# Altium schematic sheet 13-MT7688AN Peripheral-C.SchDoc
size 558 x 457 mm
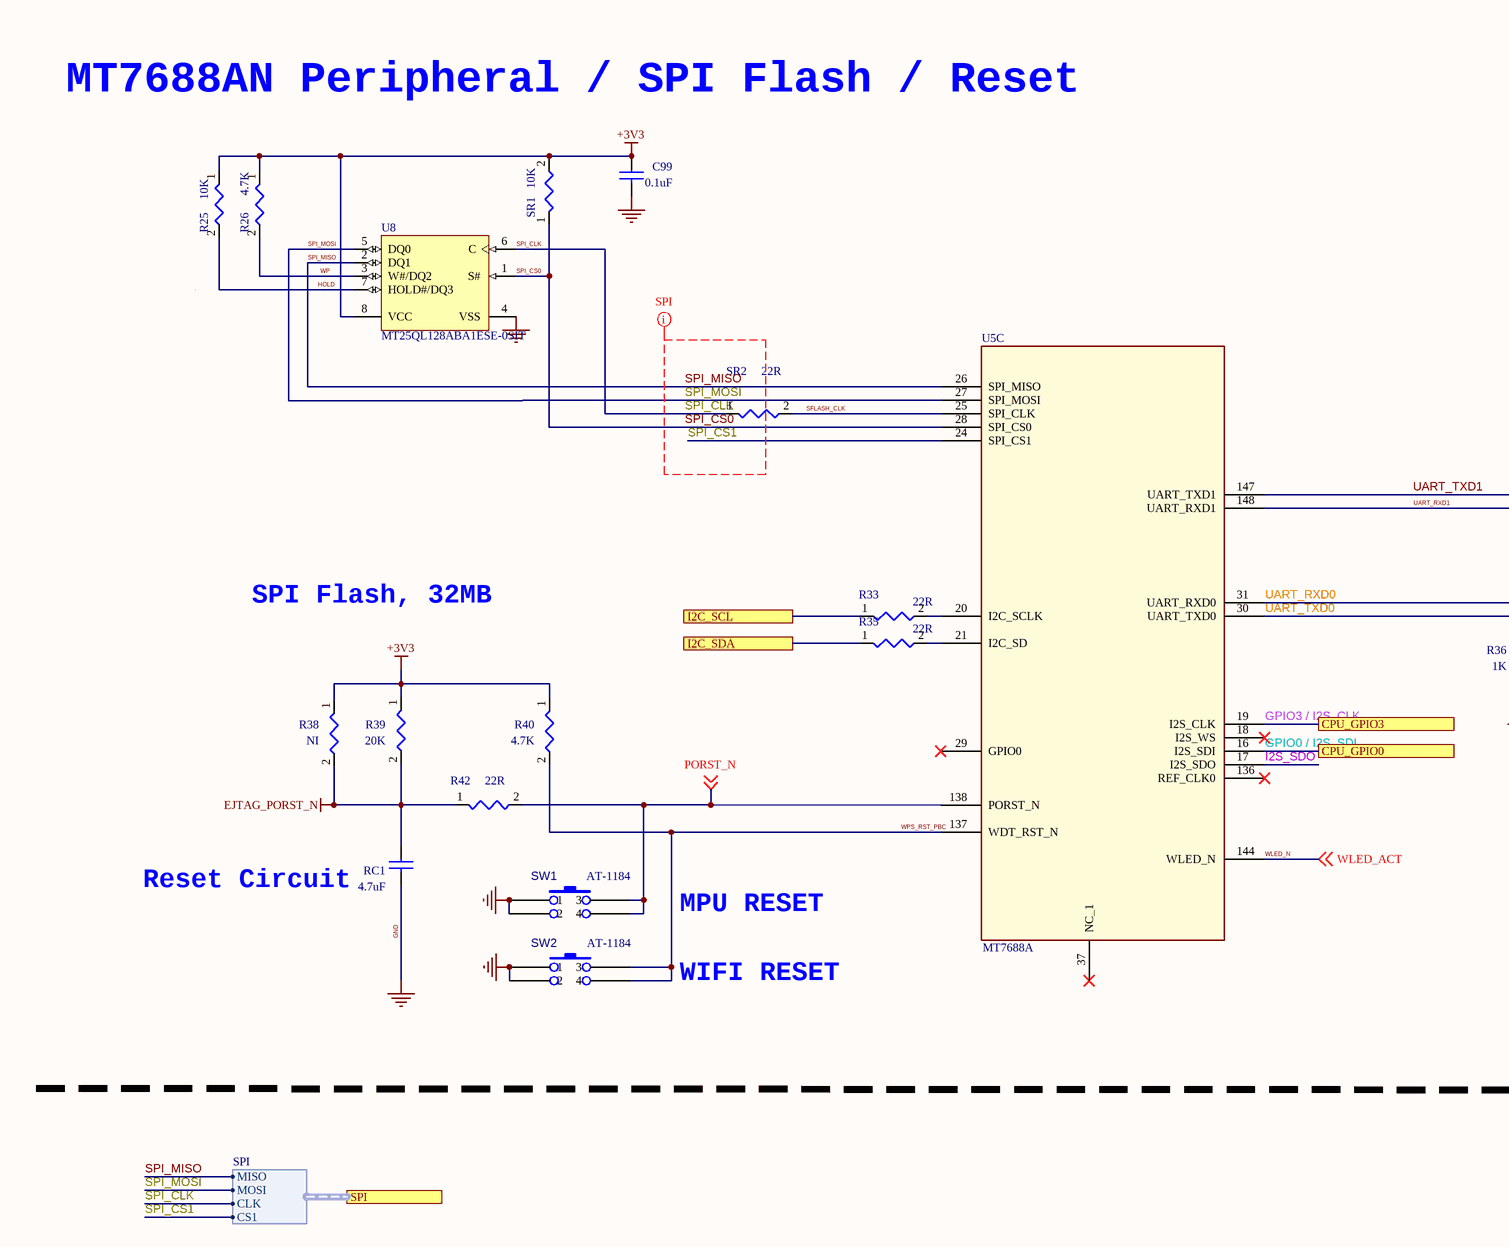
[diagram p0: 13-MT7688AN Peripheral-C.SchDoc, top left]
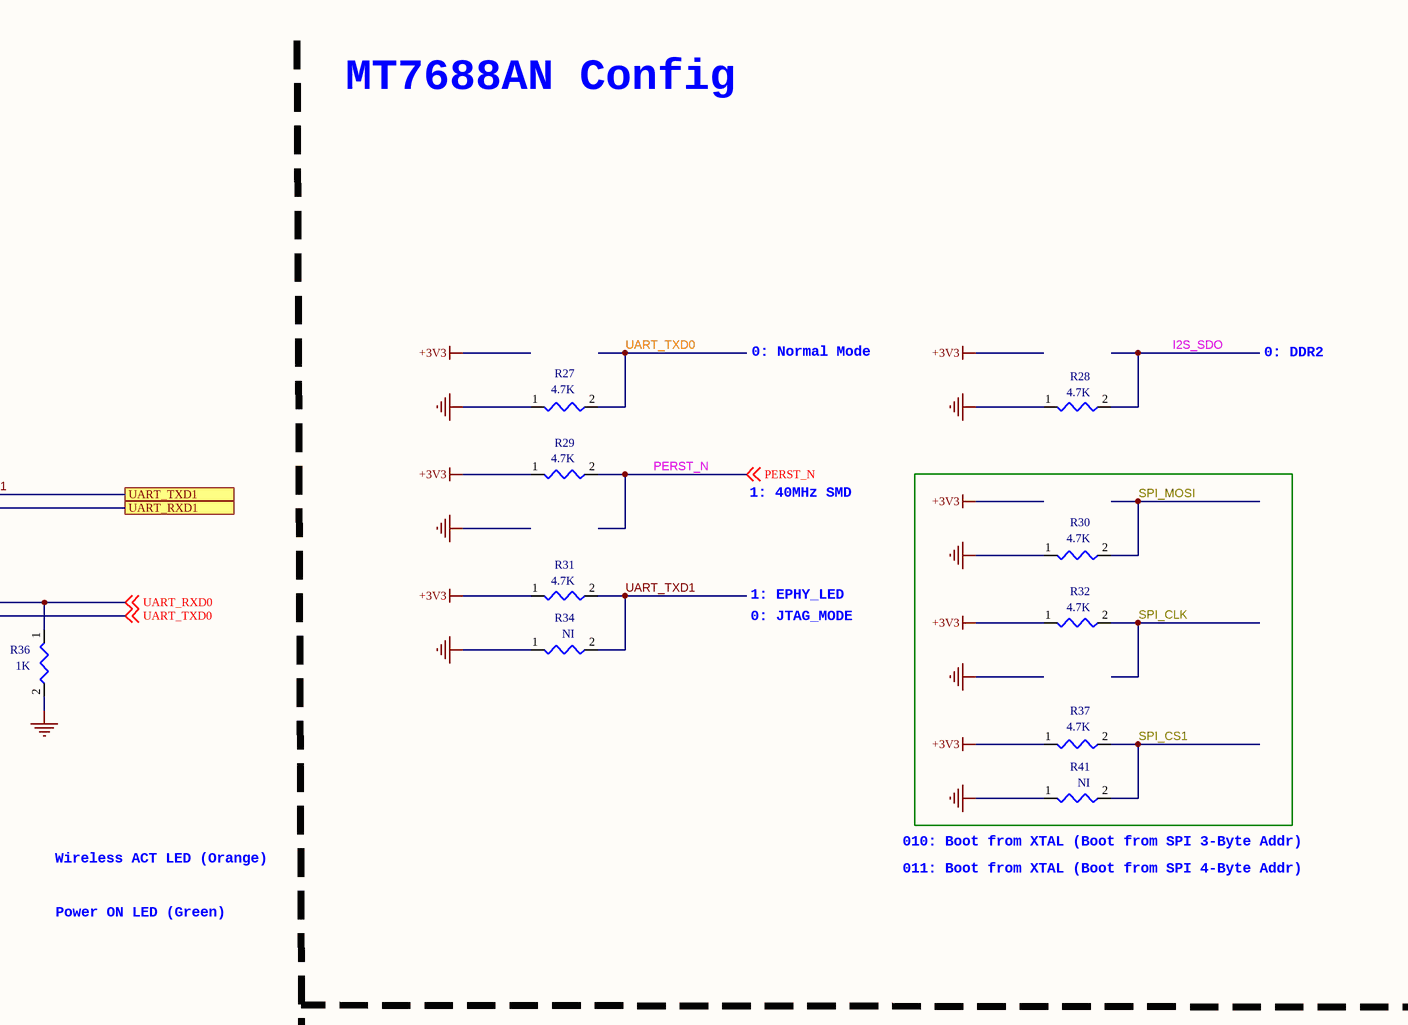
[diagram p1: 13-MT7688AN Peripheral-C.SchDoc, top right]
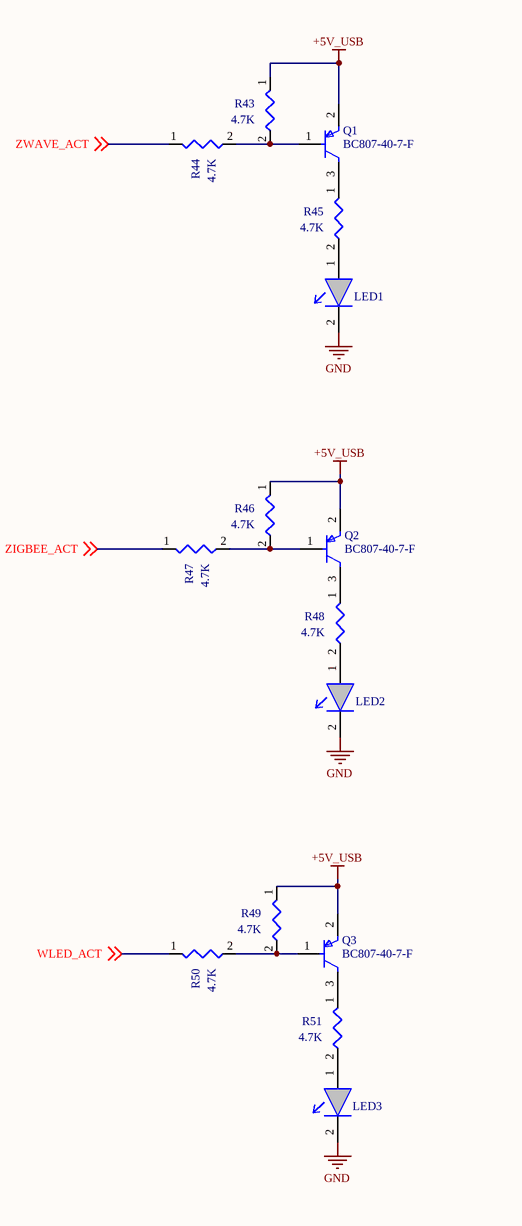
[diagram p2: 13-MT7688AN Peripheral-C.SchDoc, bottom left]
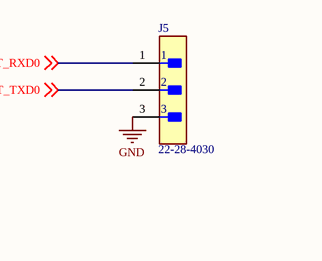
[diagram p3: 13-MT7688AN Peripheral-C.SchDoc, bottom right]

## Parts
C99  0.1uF  [CAPC1005X60X30NL05T10]
J5  22-28-4030  [FP-22-28-4030-MFG]
LED1  LED 2P  [LED3MM 2P]  (value not drawn)
LED2  LED 2P  [LED3MM 2P]  (value not drawn)
LED3  LED 2P  [LED3MM 2P]  (value not drawn)
Q1  BC807-40-7-F  [FP-SOT23-MFG]
Q2  BC807-40-7-F  [FP-SOT23-MFG]
Q3  BC807-40-7-F  [FP-SOT23-MFG]
R25  10K  [RESC1005X35X25NL10T10]
R26  4.7K  [RESC1005X35X25NL10T10]
R27  4.7K  [RESC1005X35X25NL10T10]
R28  4.7K  [RESC1005X35X25NL10T10]
R29  4.7K  [RESC1005X35X25NL10T10]
R30  4.7K  [RESC1005X35X25NL10T10]
R31  4.7K  [RESC1005X35X25NL10T10]
R32  4.7K  [RESC1005X35X25NL10T10]
R33  22R  [RESC1005X35X25NL10T10]
R34  NI  [RESC1005X35X25NL10T10]
R35  22R  [RESC1005X35X25NL10T10]
R36  1K  [RESC1005X35X25NL10T10]
R37  4.7K  [RESC1005X35X25NL10T10]
R38  NI  [RESC1005X35X25NL10T10]
R39  20K  [RESC1005X35X25NL10T10]
R40  4.7K  [RESC1005X35X25NL10T10]
R41  NI  [RESC1005X35X25NL10T10]
R42  22R  [RESC1005X35X25NL10T10]
R43  4.7K  [RESC1005X35X25NL10T10]
R44  4.7K  [RESC1005X35X25NL10T10]
R45  4.7K  [RESC1609X50X30NL10T20]
R46  4.7K  [RESC1005X35X25NL10T10]
R47  4.7K  [RESC1005X35X25NL10T10]
R48  4.7K  [RESC1609X50X30NL10T20]
R49  4.7K  [RESC1005X35X25NL10T10]
R50  4.7K  [RESC1005X35X25NL10T10]
R51  4.7K  [RESC1609X50X30NL10T20]
RC1  4.7uF  [CAPC1005X60X30NL05T10]
SR1  10K  [RESC1005X35X25NL10T10]
SR2  22R  [RESC1005X35X25NL10T10]
SW1  AT-1184  [AT-1184 SW]
SW2  AT-1184  [AT-1184 SW]
U5  MT7688A  [MT7628AN$2F$DRQFN156$2F$SMD$2F$P0.5$2F$12X12]  (part C of 6)
U8  MT25QL128ABA1ESE-0SIT  [SOIC8_N]

## Ports
CPU_GPIO0, CPU_GPIO3, I2C_SCL, I2C_SDA, SPI (harness SPI), UART_RXD1, UART_TXD1

## Harnesses
SPI: MISO, MOSI, CLK, CS1

## Nets
+3V3: C99.1 R25.1 R26.1 R29.1 R31.1 R32.1 R37.1 R38.1 R39.1 R40.1 SR1.2 U8.8(VCC)
+5V_USB: Q1.2(E) Q2.2(E) Q3.2(E) R43.1 R46.1 R49.1
EJTAG_PORST_N: R38.2 R39.2 R42.1 RC1.1
GND: C99.2 J5.3 LED1.2 LED2.2 LED3.2 R27.1 R28.1 R30.1 R34.1 R36.2 R41.1 RC1.2 SW1.1 SW1.2 SW2.1 SW2.2 U8.4(VSS)
GPIO0 / I2S_SDI: U5.16(I2S_SDI) ; port CPU_GPIO0
GPIO3 / I2S_CLK: U5.19(I2S_CLK) ; port CPU_GPIO3
HOLD: R25.2 U8.7(HOLD#/DQ3)
I2C_SCL: R33.1 ; port I2C_SCL
I2C_SDA: R35.1 ; port I2C_SDA
I2S_SDO: R28.2 U5.17(I2S_SDO)
PERST_N: R29.2 ; off-sheet PERST_N
PORST_N: R42.2 SW1.3 SW1.4 U5.138(PORST_N) ; off-sheet PORST_N
SFLASH_CLK: SR2.2 U5.25(SPI_CLK)
SPI_CLK: R32.2 SR2.1 U8.6(C) ; port SPI.CLK
SPI_CS0: SR1.1 U5.28(SPI_CS0) U8.1(S#)
SPI_CS1: R37.2 R41.2 U5.24(SPI_CS1) ; port SPI.CS1
SPI_MISO: U5.26(SPI_MISO) U8.2(DQ1) ; port SPI.MISO
SPI_MOSI: R30.2 U5.27(SPI_MOSI) U8.5(DQ0) ; port SPI.MOSI
UART_RXD0: J5.1 R36.1 U5.31(UART_RXD0) ; off-sheet UART_RXD0
UART_RXD1: U5.148(UART_RXD1) ; port UART_RXD1
UART_TXD0: J5.2 R27.2 U5.30(UART_TXD0) ; off-sheet UART_TXD0
UART_TXD1: R31.2 R34.2 U5.147(UART_TXD1) ; port UART_TXD1
WLED_N: R50.1 U5.144(WLED_N) ; off-sheet WLED_ACT  [also labelled WLED_ACT]
WP: R26.2 U8.3(W#/DQ2)
WPS_RST_PBC: R40.2 SW2.3 SW2.4 U5.137(WDT_RST_N)
ZIGBEE_ACT: R47.1 ; off-sheet ZIGBEE_ACT
ZWAVE_ACT: R44.1 ; off-sheet ZWAVE_ACT
NetLED1_1: LED1.1 R45.2
NetLED2_1: LED2.1 R48.2
NetLED3_1: LED3.1 R51.2
NetQ1_1: Q1.1(B) R43.2 R44.2
NetQ1_3: Q1.3(C) R45.1
NetQ2_1: Q2.1(B) R46.2 R47.2
NetQ2_3: Q2.3(C) R48.1
NetQ3_1: Q3.1(B) R49.2 R50.2
NetQ3_3: Q3.3(C) R51.1
NetR33_2: R33.2 U5.20(I2C_SCLK)
NetR35_2: R35.2 U5.21(I2C_SD)

Not connected (* = marked no-connect by the designer): U5 18(I2S_WS)* 29(GPIO0)* 37(NC_1)* 136(REF_CLK0)*

## Layout directives
net class SPI: SPI_CLK, SPI_CS0, SPI_CS1, SPI_MISO, SPI_MOSI

## Notes on the sheet
- MT7688AN Peripheral / SPI Flash / Reset
- MT7688AN Config
- 0: Normal Mode
- 0: DDR2
- 1: 40MHz SMD
- SPI Flash, 32MB
- 1: EPHY_LED
- 0: JTAG_MODE
- (near R41) 010: Boot from XTAL (Boot from SPI 3-Byte Addr)
- Reset Circuit
- MPU RESET
- Wireless ACT LED (Orange)
- 011: Boot from XTAL (Boot from SPI 4-Byte Addr)
- Power ON LED (Green)
- WIFI RESET

## Library data of the parts
C99 RC1 = CAP NP
J5 = CMP-04776-000098-1: CONN HEADER VERT 3POS 2.54MM; Manufacturer: Molex; Conn Orientation: Vertical; Conn Gender: Male; Current Rating: 4A; Voltage Rating: 500V; Number Of Contacts: 3; Category: Conn; Number Of Rows: 1; Manufacturer Part Number: 22-28-4030; RoHS: TRUE; Package: 22-28-4030; Footprint Url: https://www.molex.com/pdm_docs/sd/022284030_sd.pdf; ComponentLink2Description: Datasheet; Device Class L2: Headers and Wire Housings; Automotive: No; Temperature Range Low: -40°C; Digikey Description: CONN HEADER VERT 3POS 2.54MM; Mouser Description: Headers & Wire Housings 3P VERT HEADER Sn; Contact Material: Gold,Nickel; Pitch: 2.54mm; Device Class L1: Connectors; Lead Free: Yes; Device Class L3: unset; Temperature Range High: +80°C; Octopart: https://octopart.com/0022284030-molex-10476094; ComponentLink2URL: https://www.molex.com/webdocs/datasheets/pdf/en-us/0022284030_PCB_HEADERS.pdf; Height: 8.88mm; Temperature: -40°C to +80°C
Q1-Q3 = CMP-12798-000025-1: TRANS PNP 45V 0.5A SOT23; Manufacturer: DIODES INC.; Gain Bandwidth Product: 100MHz; Hfe Testic: -100mA; Automotive Grade: Grade 0; Max Junction Temp: +150°C; Hfe Testvce: -1V; Collector Base Voltage: -50V; Collector Emitter Voltage: -45V; Hfe Min: 250; Power Dissipation: 310mW; Rthja Max: 403°C/W; Emitter Base Voltage: -5V; Collector Emitter Saturation Voltage: -0.7V; Hfe Max: 600; Number Of Pnp: 1; Max Collector Current: -0.5A; Standoff Height: 0.013mm; Height: 1.1mm; Octopart: https://octopart.com/bc807-40-7-f-diodes+inc.-354302; Temperature: -55°C to +150°C; Device Class L1: Discrete Semiconductors; Manufacturer Part Number: BC807-40-7-F; Digikey Description: TRANS PNP 45V 0.5A SOT23; Temperature Range High: +150°C; Mouser Description: Bipolar Transistors - BJT PNP BIPOLAR; Temperature Range Low: -55°C; Device Class L2: Transistors; Category: Trans; Device Class L3: BJTs; Automotive: Yes; Package: SOT23; ComponentLink2Description: Datasheet; Ipc Land Pattern Name: SOT92P240X102-3; ComponentLink2URL: https://www.diodes.com/assets/Datasheets/ds11208.pdf; RoHS: TRUE; Footprint Url: https://www.diodes.com/assets/Package-Files/SOT23.pdf; Number Of Elements: 1; Collector Emitter Breakdown Voltage: -45V; Lead Free: Yes
R25-R51 SR1 SR2 = RES/0402_3
SW1 SW2 = SW: TACT Switch, H=1.5mm; Manufacturer: Panasonic - ECG; Manufacturer P/N: EVQ-Q2B01W; Distributor P/N: P12930SCT-ND; Distributor: Digikey
U5 = MT7620N-n_26
U8 = CMP-2000-07468-1: Micron Serial NOR Flash Memory, 2.7 to 3.6 V, 128 Mb, -40 to 85 degC, 8-Pin SOP2 (SE), RoHS, Tape and Reel; Mounting Technology: SurfaceMount; Package Reference: SE-8; Package Description: 8-Pin Small Outline Package, Body 5.285 x 5.285 mm, Pitch 1.27 mm; Manufacturer: Micron; Manufacturer URL: http://www.micron.com/; Datasheet URL: https://www.micron.com/~/media/documents/products/data-sheet/nor-flash/serial-nor/mt25q/die-rev-a/mt25q_qlhs_l_128_aba_0.pdf; Datasheet Version: Rev. I , 09/2016; RoHSCompliant: true